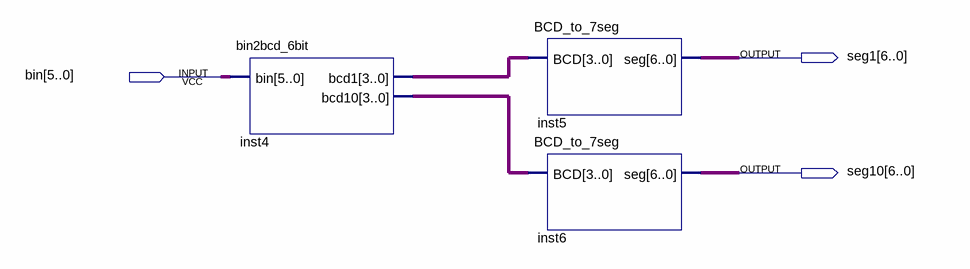
[diagram p0: schematic sheet]
// Quartus schematic bin2seg6bit.bdf as structural Verilog: 3 symbols, 3 pins
module bin2seg6bit (
  input  [5:0] bin,
  output [6:0] seg1,
  output [6:0] seg10
);

  wire [3:0] inst4_bcd1, inst4_bcd10;

  bin2bcd_6bit inst4 (.bin(bin), .bcd1(inst4_bcd1), .bcd10(inst4_bcd10));
  BCD_to_7seg inst5 (.BCD(inst4_bcd1), .seg(seg1));
  BCD_to_7seg inst6 (.BCD(inst4_bcd10), .seg(seg10));
endmodule
